# EAGLE design pycubed (EAGLE 9.6.2)
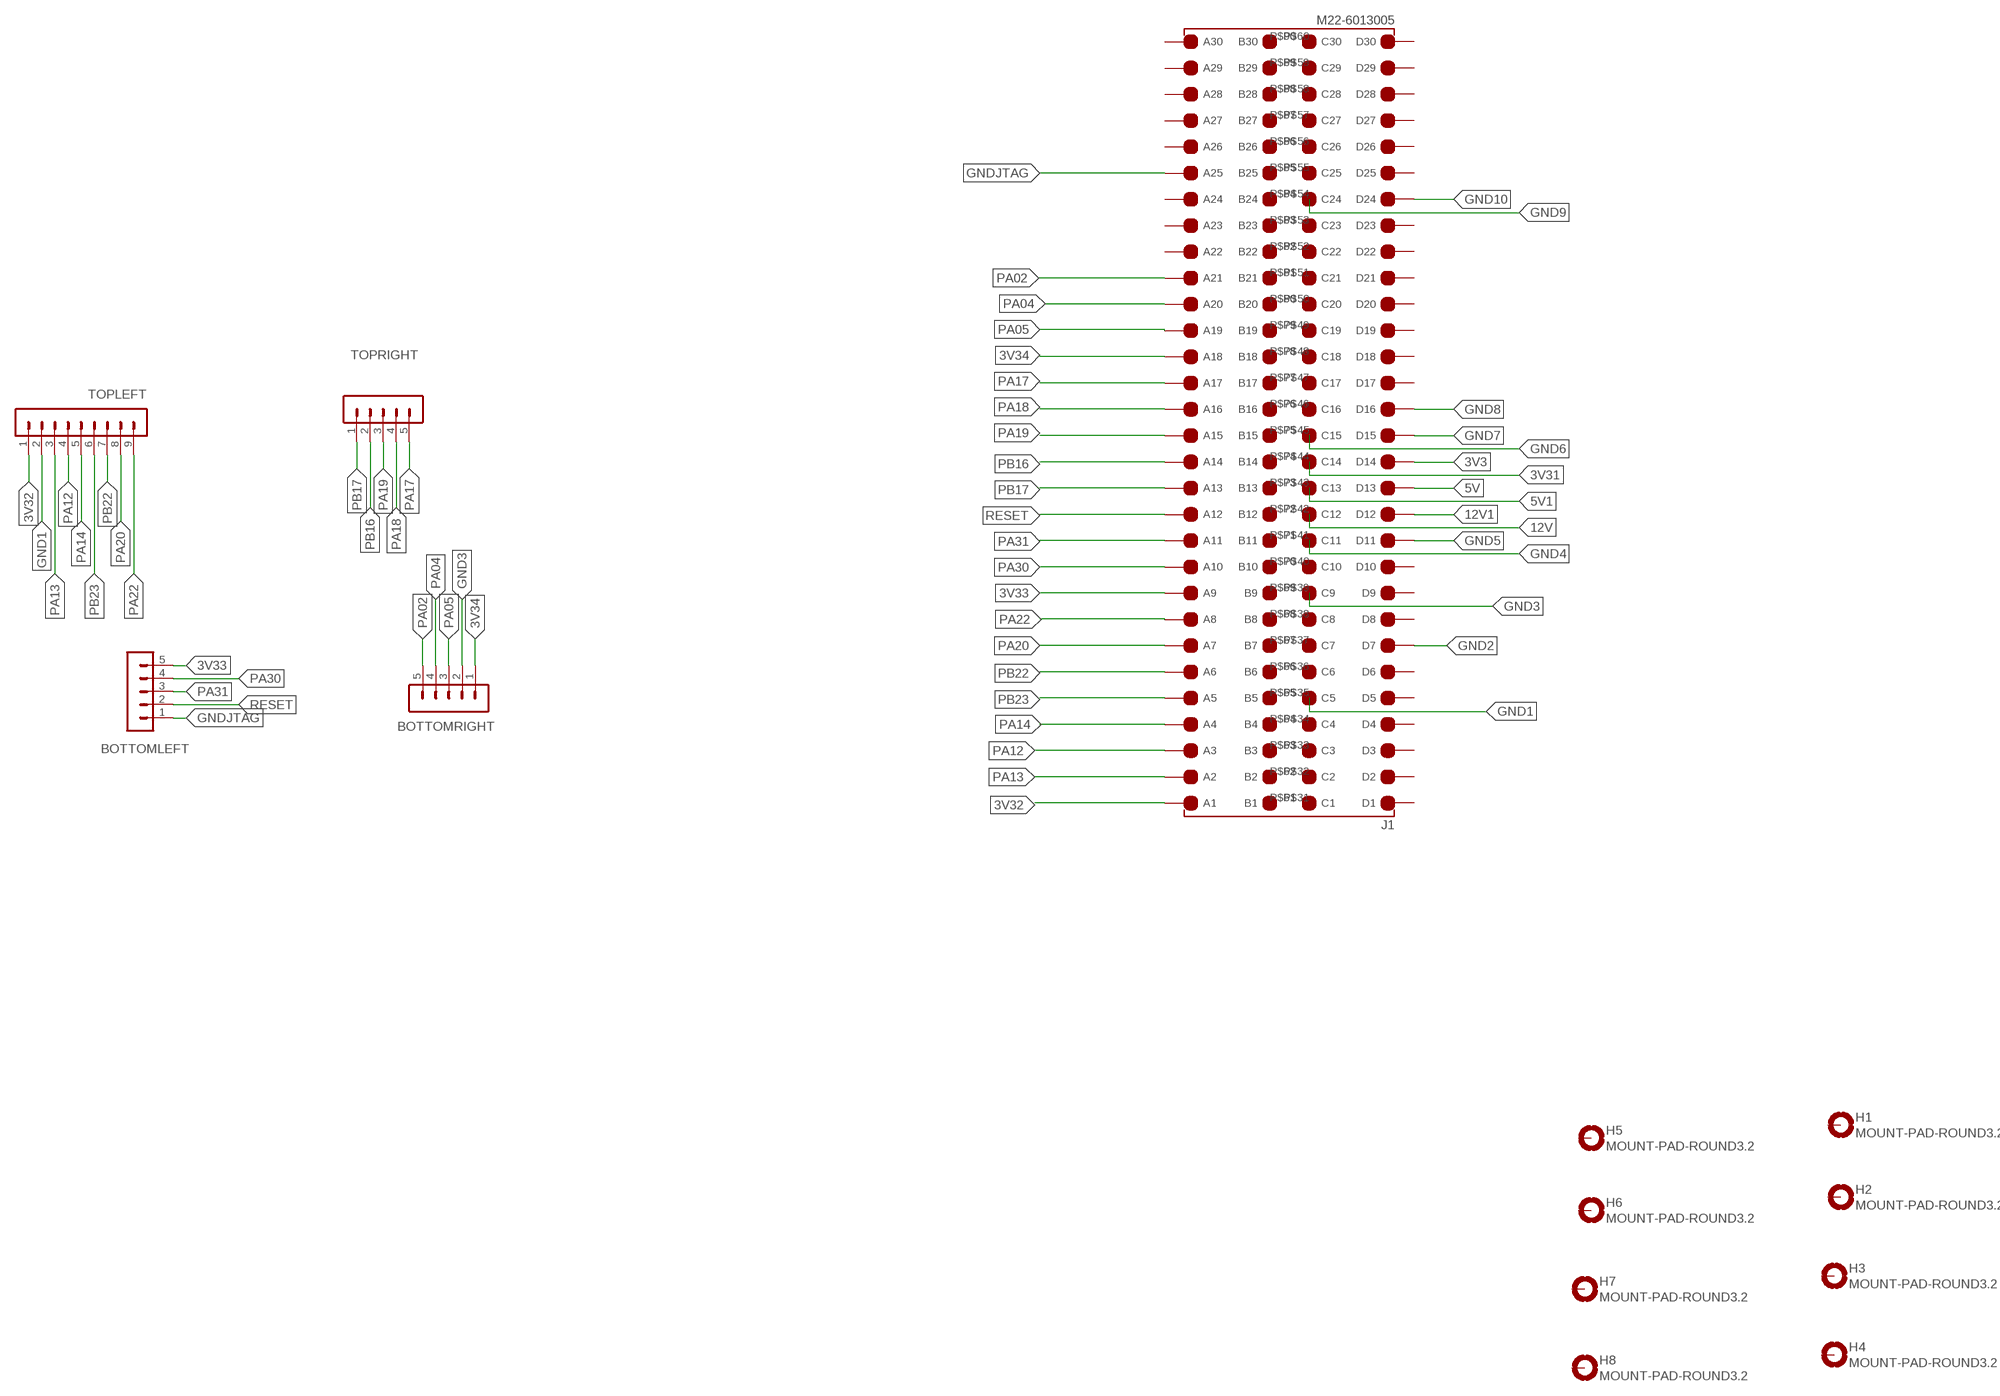
[diagram p0: schematic, sheet 1]

## Parts
BOTTOMLEFT  MA05-1  [MA05-1]
BOTTOMRIGHT  MA05-1  [MA05-1]
H1  MOUNT-PAD-ROUND3.2  [3,2-PAD]
H2  MOUNT-PAD-ROUND3.2  [3,2-PAD]
H3  MOUNT-PAD-ROUND3.2  [3,2-PAD]
H4  MOUNT-PAD-ROUND3.2  [3,2-PAD]
H5  MOUNT-PAD-ROUND3.2  [3,2-PAD]
H6  MOUNT-PAD-ROUND3.2  [3,2-PAD]
H7  MOUNT-PAD-ROUND3.2  [3,2-PAD]
H8  MOUNT-PAD-ROUND3.2  [3,2-PAD]
J1  M22-6013005  [RHDR120W55P200_4X30_6020X820X9]
TOPLEFT  MA09-1  [MA09-1]
TOPRIGHT  MA05-1  [MA05-1]

## Nets
3V3: J1.P$14(D14)
3V31: J1.P$44(C14)
3V32: J1.P$91(A1) TOPLEFT.1
3V33: BOTTOMLEFT.5 J1.P$99(A9)
3V34: BOTTOMRIGHT.1 J1.P$108(A18)
5V: J1.P$13(D13)
5V1: J1.P$43(C13)
12V: J1.P$42(C12)
12V1: J1.P$12(D12)
GND1: J1.P$35(C5) TOPLEFT.2
GND2: J1.P$7(D7)
GND3: BOTTOMRIGHT.2 J1.P$39(C9)
GND4: J1.P$41(C11)
GND5: J1.P$11(D11)
GND6: J1.P$45(C15)
GND7: J1.P$15(D15)
GND8: J1.P$16(D16)
GND9: J1.P$54(C24)
GND10: J1.P$24(D24)
GNDJTAG: BOTTOMLEFT.1 J1.P$115(A25)
PA02: BOTTOMRIGHT.5 J1.P$111(A21)
PA04: BOTTOMRIGHT.4 J1.P$110(A20)
PA05: BOTTOMRIGHT.3 J1.P$109(A19)
PA12: J1.P$93(A3) TOPLEFT.4
PA13: J1.P$92(A2) TOPLEFT.3
PA14: J1.P$94(A4) TOPLEFT.5
PA17: J1.P$107(A17) TOPRIGHT.5
PA18: J1.P$106(A16) TOPRIGHT.4
PA19: J1.P$105(A15) TOPRIGHT.3
PA20: J1.P$97(A7) TOPLEFT.8
PA22: J1.P$98(A8) TOPLEFT.9
PA30: BOTTOMLEFT.4 J1.P$100(A10)
PA31: BOTTOMLEFT.3 J1.P$101(A11)
PB16: J1.P$104(A14) TOPRIGHT.2
PB17: J1.P$103(A13) TOPRIGHT.1
PB22: J1.P$96(A6) TOPLEFT.7
PB23: J1.P$95(A5) TOPLEFT.6
RESET: BOTTOMLEFT.2 J1.P$102(A12)
Unconnected: H1.B3,2(MOUNT) H2.B3,2(MOUNT) H3.B3,2(MOUNT) H4.B3,2(MOUNT) H5.B3,2(MOUNT) H6.B3,2(MOUNT) H7.B3,2(MOUNT) H8.B3,2(MOUNT) J1.P$1(D1) J1.P$2(D2) J1.P$3(D3) J1.P$4(D4) J1.P$5(D5) J1.P$6(D6) J1.P$8(D8) J1.P$9(D9) J1.P$10(D10) J1.P$17(D17) J1.P$18(D18) J1.P$19(D19) J1.P$20(D20) J1.P$21(D21) J1.P$22(D22) J1.P$23(D23) J1.P$25(D25) J1.P$26(D26) J1.P$27(D27) J1.P$28(D28) J1.P$29(D29) J1.P$30(D30) J1.P$31(C1) J1.P$32(C2) J1.P$33(C3) J1.P$34(C4) J1.P$36(C6) J1.P$37(C7) J1.P$38(C8) J1.P$40(C10) J1.P$46(C16) J1.P$47(C17) J1.P$48(C18) J1.P$49(C19) J1.P$50(C20) J1.P$51(C21) J1.P$52(C22) J1.P$53(C23) J1.P$55(C25) J1.P$56(C26) J1.P$57(C27) J1.P$58(C28) J1.P$59(C29) J1.P$60(C30) J1.P$61(B1) J1.P$62(B2) J1.P$63(B3) J1.P$64(B4) J1.P$65(B5) J1.P$66(B6) J1.P$67(B7) J1.P$68(B8) J1.P$69(B9) J1.P$70(B10) J1.P$71(B11) J1.P$72(B12) J1.P$73(B13) J1.P$74(B14) J1.P$75(B15) J1.P$76(B16) J1.P$77(B17) J1.P$78(B18) J1.P$79(B19) J1.P$80(B20) J1.P$81(B21) J1.P$82(B22) J1.P$83(B23) J1.P$84(B24) J1.P$85(B25) J1.P$86(B26) J1.P$87(B27) J1.P$88(B28) J1.P$89(B29) J1.P$90(B30) J1.P$112(A22) J1.P$113(A23) J1.P$114(A24) J1.P$116(A26) J1.P$117(A27) J1.P$118(A28) J1.P$119(A29) J1.P$120(A30)

## Library data of the parts
BOTTOMLEFT BOTTOMRIGHT TOPRIGHT = con-lstb:MA05-1: PIN HEADER; OC_FARNELL: unknown; OC_NEWARK: unknown
H1-H8 = holes:MOUNT-PAD-ROUND: MOUNTING PAD, round
J1 = M22-6013005:M22-6013005: HARWIN - M22-6013005 - PCB Receptacle, Board-to-Board, 2 mm, 4 Rows, 120 Contacts, Through Hole Mount, M22 Series Source: Datasheet <https://ms.componentsearchengine.com/Datasheets/2/M22-6013005.pdf>; DESCRIPTION: HARWIN - M22-6013005 - PCB Receptacle, Board-to-Board, 2 mm, 4 Rows, 120 Contacts, Through Hole Mount, M22 Series; HEIGHT: 9.65mm; MANUFACTURER_NAME: Harwin; MANUFACTURER_PART_NUMBER: M22-6013005
TOPLEFT = con-lstb:MA09-1: PIN HEADER; OC_FARNELL: unknown; OC_NEWARK: unknown

## Board
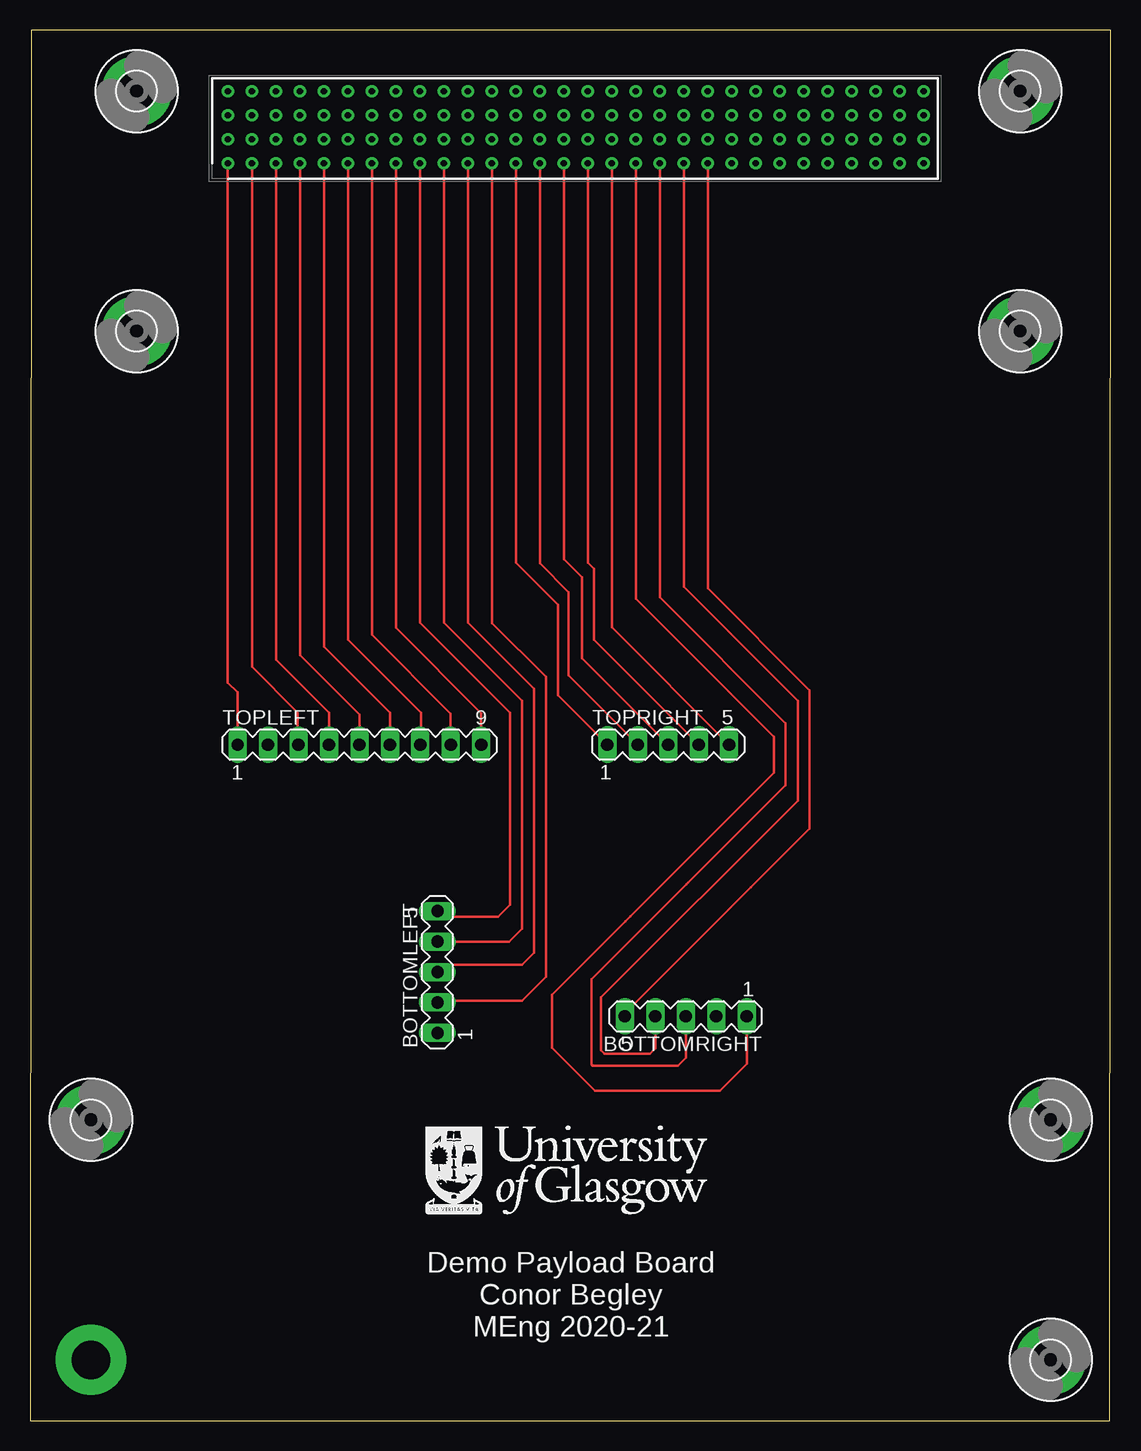
[diagram p1: board, top side]
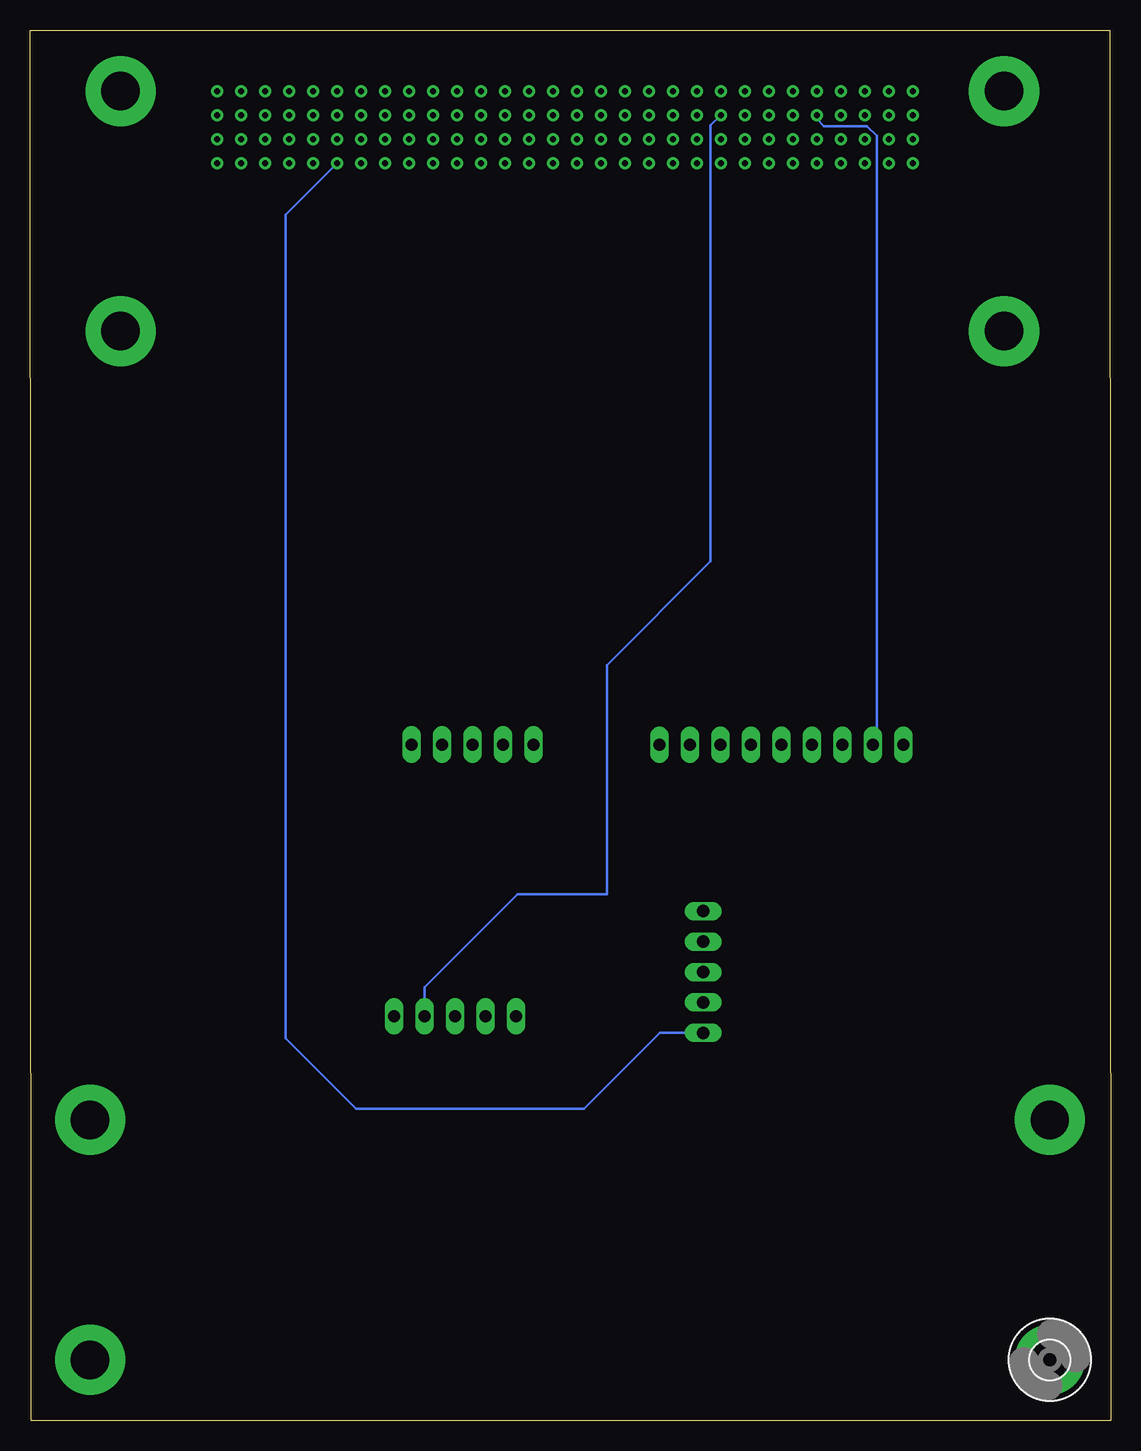
[diagram p2: board, bottom side, seen from below]

Size 90.1 x 115.9 mm. Coordinates in mm from the lower left corner, seen from the top.
Outline: 0,0 90,0 90.1,115.9 0.1,115.9 0,0
Copper layers (1*16): Top 0.035mm / dielectric 1.5mm / Bottom 0.035mm
Design rules "jlcpcb *": minimum track width 6mil, minimum drill 0.35mm, track to track 0.2mm, track to pad 0.2mm, pad to pad 0.54mm, via to via 10mil, smd to smd 6mil, copper to edge 40mil, drill to drill 6mil, minimum pad ring 10mil, minimum via ring 8mil, stop-mask expansion 4mil, vias tented up to drill 0mil, thermal gap 10mil

### Footprints (pad centres in the part's own frame; a part is rotated, then mirrored left to right if it is on the bottom)
MA05-1 = drill 1.016 long: 1 -5.08,0; 2 -2.54,0; 3 0,0; 4 2.54,0; 5 5.08,0
3,2-PAD = drill 3.2 pad 5.842: B3,2 0,0
RHDR120W55P200_4X30_6020X820X9 = drill 0.505 pad 0.9: P$1 0,6; P$2 2,6; P$3 4,6; P$4 6,6; P$5 8,6; P$6 10,6; P$7 12,6; P$8 14,6; P$9 16,6; P$10 18,6; P$11 20,6; P$12 22,6; P$13 24,6; P$14 26,6; P$15 28,6; P$16 30,6; P$17 32,6; P$18 34,6; P$19 36,6; P$20 38,6; P$21 40,6; P$22 42,6; P$23 44,6; P$24 46,6; P$25 48,6; P$26 50,6; P$27 52,6; P$28 54,6; P$29 56,6; P$30 58,6; P$31 0,4; P$32 2,4; P$33 4,4; P$34 6,4; P$35 8,4; P$36 10,4; P$37 12,4; P$38 14,4; P$39 16,4; P$40 18,4; P$41 20,4; P$42 22,4; P$43 24,4; P$44 26,4; P$45 28,4; P$46 30,4; P$47 32,4; P$48 34,4; P$49 36,4; P$50 38,4; P$51 40,4; P$52 42,4; P$53 44,4; P$54 46,4; P$55 48,4; P$56 50,4; P$57 52,4; P$58 54,4; P$59 56,4; P$60 58,4; P$61 0,2; P$62 2,2; P$63 4,2; P$64 6,2; P$65 8,2; P$66 10,2; P$67 12,2; P$68 14,2; P$69 16,2; P$70 18,2; P$71 20,2; P$72 22,2; P$73 24,2; P$74 26,2; P$75 28,2; P$76 30,2; P$77 32,2; P$78 34,2; P$79 36,2; P$80 38,2; P$81 40,2; P$82 42,2; P$83 44,2; P$84 46,2; P$85 48,2; P$86 50,2; P$87 52,2; P$88 54,2; P$89 56,2; P$90 58,2; P$91 0,0; P$92 2,0; P$93 4,0; P$94 6,0; P$95 8,0; P$96 10,0; P$97 12,0; P$98 14,0; P$99 16,0; P$100 18,0; P$101 20,0; P$102 22,0; P$103 24,0; P$104 26,0; P$105 28,0; P$106 30,0; P$107 32,0; P$108 34,0; P$109 36,0; P$110 38,0; P$111 40,0; P$112 42,0; P$113 44,0; P$114 46,0; P$115 48,0; P$116 50,0; P$117 52,0; P$118 54,0; P$119 56,0; P$120 58,0
MA09-1 = drill 1.016 long: 1 -10.16,0; 2 -7.62,0; 3 -5.08,0; 4 -2.54,0; 5 0,0; 6 2.54,0; 7 5.08,0; 8 7.62,0; 9 10.16,0

### Placement (x,y rotation side)
BOTTOMLEFT  33.97,37.4 90 top
BOTTOMRIGHT  54.67,33.71 180 top
H1  5.08,5.08 0 bottom
H2  85.09,5.08 0 top
H3  8.89,110.81 0 top
H4  82.55,110.81 0 top
H5  8.89,90.81 0 top
H6  82.55,90.81 0 top
H7  5.08,25.08 0 top
H8  85.09,25.08 0 top
J1  16.5,104.8 0 top
TOPLEFT  27.46,56.34 0 top
TOPRIGHT  53.21,56.35 0 top

### Tracks (layer width: path | path; a pad name or v marks a point on that pad's centre or on a via)
3V32
  Top 0.2: J1.P$91 16.49,61.51 17.3,60.7 TOPLEFT.1
3V33
  Top 0.2: J1.P$99 32.5,66.5 40,59 40,43 39,42 34.45,42 BOTTOMLEFT.5
3V34
  Top 0.2: J1.P$108 50.5,68.5 62,57 62,54 50.05,42.05 49.65,41.65 43.5,35.5 43.5,31.1 47.1,27.5 57.5,27.5 59.75,29.75 BOTTOMRIGHT.1
GND1
  Bottom 0.2: TOPLEFT.2 19.51,56.67 19.51,104.08 19.51,107.08 20.33,107.9 23.9,107.9 24.5,108.5 J1.P$35
GND3
  Bottom 0.2: J1.P$39 33.35,107.95 33.35,71.62 42,62.97 42,43.88 49.44,43.88 57.21,36.11 BOTTOMRIGHT.2
GNDJTAG
  Bottom 0.2: BOTTOMLEFT.1 37.58,32.32 43.9,26 62.9,26 68.8,31.9 68.8,100.5 J1.P$115
PA02
  Top 0.2: J1.P$111 56.5,69.36 64.98,60.88 64.98,49.32 60.11,44.45 60.11,44.47 49.59,33.95 BOTTOMRIGHT.5
PA04
  Top 0.2: J1.P$110 54.5,69.5 64,60 64,51.68 47.6,35.28 47.6,30.9 47.9,30.6 51.7,30.6 52.13,31.03 BOTTOMRIGHT.4
PA05
  Top 0.2: J1.P$109 52.5,68.61 62.96,58.15 62.96,56.8 62.96,52.96 54.85,44.85 54.73,44.73 46.8,36.8 46.8,29.7 46.9,29.6 54,29.6 54.67,30.27 BOTTOMRIGHT.3
PA12
  Top 0.2: J1.P$93 20.5,63.41 24.92,58.99 TOPLEFT.4
PA13
  Top 0.2: TOPLEFT.3 22.33,56.39 22.33,58.99 18.5,62.82 J1.P$92
PA14
  Top 0.2: J1.P$94 22.5,63.81 27.46,58.85 TOPLEFT.5
PA17
  Top 0.2: TOPRIGHT.5 48.5,66.14 J1.P$107
PA18
  Top 0.2: TOPRIGHT.4 47,65.1 47,71 46.5,71.5 J1.P$106
PA19
  Top 0.2: TOPRIGHT.3 46,63.56 46,70.3 44.5,71.8 J1.P$105
PA20
  Top 0.2: TOPLEFT.8 35.08,58.92 28.5,65.5 J1.P$97
PA22
  Top 0.2: J1.P$98 30.5,66.09 37.62,58.97 TOPLEFT.9
PA30
  Top 0.2: J1.P$100 34.5,66.5 41,60 41,41 39.94,39.94 BOTTOMLEFT.4
PA31
  Top 0.2: J1.P$101 36.5,66.5 42,61 42,39 41,38 34.57,38 BOTTOMLEFT.3
PB16
  Top 0.2: TOPRIGHT.2 44.9,62.12 44.9,69.07 42.5,71.47 J1.P$104
PB17
  Top 0.2: TOPRIGHT.1 44,60.48 44,68 40.5,71.5 J1.P$103
PB22
  Top 0.2: J1.P$96 26.52,104.78 26.52,65.08 32.61,58.99 32.59,58.99 32.59,56.39 TOPLEFT.7
PB23
  Top 0.2: J1.P$95 24.5,64.51 30.02,58.99 30.02,56.36 TOPLEFT.6
RESET
  Top 0.2: BOTTOMLEFT.2 34.11,35 41,35 43,37 43,62 38.52,66.48 38.52,104.78 J1.P$102

### Text on the board
tPlace: C:/Users/Conor Begley/Documents/EAGLE/projects/FlatSat/glasgow-caledonian-logoW.bmp | Demo Payload Board / Conor Begley / MEng 2020-21